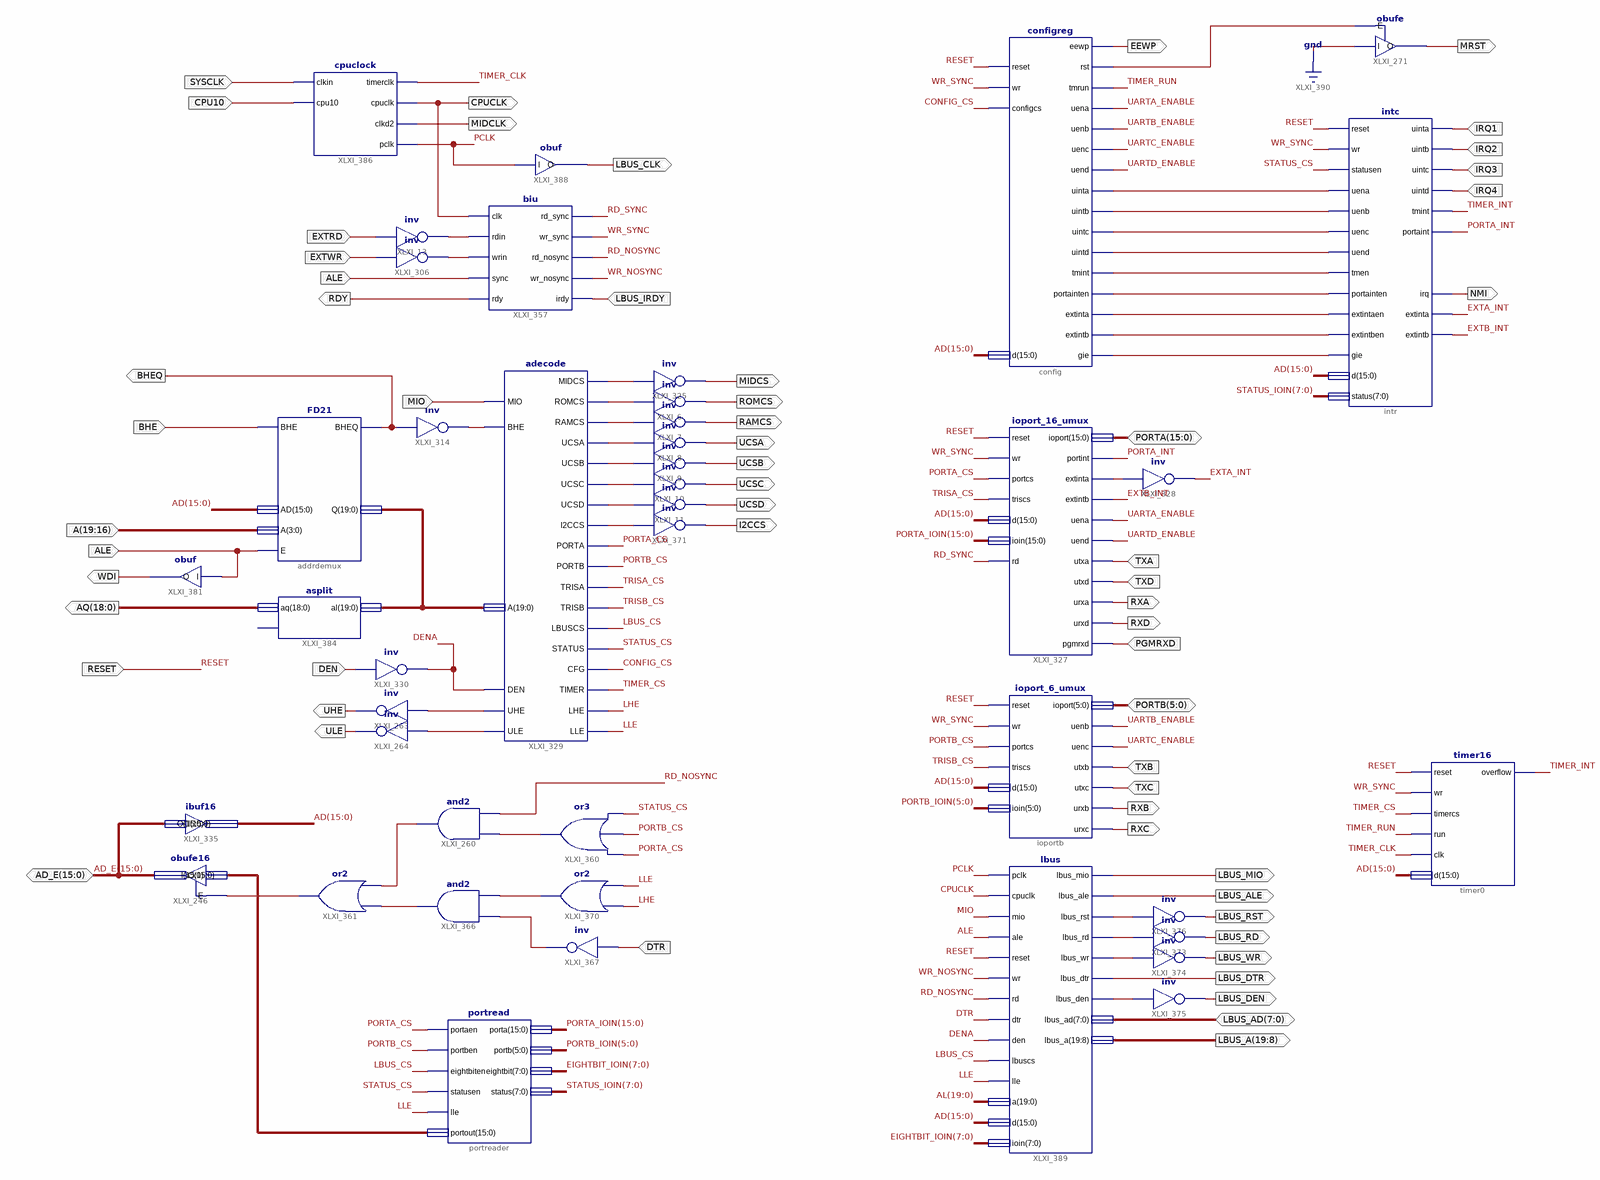
[diagram p0: schematic sheet 1]
// Xilinx ISE schematic main.sch (xc9500) as structural Verilog: 42 symbols, 57 ports
module main (
  input  ALE,
  input  RESET,
  input  EXTWR,
  input  EXTRD,
  input  SYSCLK,
  input  CPU10,
  input  BHE,
  input  [19:16] A,
  input  MIO,
  input  IRQ1,
  input  IRQ4,
  input  IRQ3,
  input  IRQ2,
  input  TXA,
  input  TXD,
  input  PGMRXD,
  input  TXB,
  input  TXC,
  input  DEN,
  input  DTR,
  input  LBUS_IRDY,
  inout  [15:0] PORTA,
  inout  [5:0] PORTB,
  inout  [15:0] AD_E,
  inout  [7:0] LBUS_AD,
  output MIDCLK,
  output ROMCS,
  output RAMCS,
  output UCSA,
  output UCSB,
  output UCSC,
  output UCSD,
  output BHEQ,
  output MIDCS,
  output NMI,
  output EEWP,
  output MRST,
  output RXA,
  output RXD,
  output RXB,
  output RXC,
  output ULE,
  output UHE,
  output I2CCS,
  output RDY,
  output WDI,
  output [18:0] AQ,
  output CPUCLK,
  output LBUS_ALE,
  output LBUS_RST,
  output LBUS_DEN,
  output LBUS_WR,
  output LBUS_RD,
  output LBUS_DTR,
  output LBUS_MIO,
  output [19:8] LBUS_A,
  output LBUS_CLK
);

  wire CONFIG_CS, DENA, EXTA_INT, EXTB_INT, LBUS_CS, LHE, LLE, PCLK, PORTA_CS, PORTA_INT, PORTB_CS,
       RD_NOSYNC, RD_SYNC, STATUS_CS, TIMER_CLK, TIMER_CS, TIMER_INT, TIMER_RUN, TRISA_CS, TRISB_CS,
       UARTA_ENABLE, UARTB_ENABLE, UARTC_ENABLE, UARTD_ENABLE, WR_NOSYNC, WR_SYNC, XLXN_19, XLXN_20, XLXN_21,
       XLXN_22, XLXN_23, XLXN_24, XLXN_444, XLXN_451, XLXN_2395, XLXN_2401, XLXN_2464, XLXN_2860, XLXN_2861,
       XLXN_2862, XLXN_2863, XLXN_2864, XLXN_2865, XLXN_2866, XLXN_2867, XLXN_2872, XLXN_3045, XLXN_3146,
       XLXN_3225, XLXN_3226, XLXN_3237, XLXN_3239, XLXN_3248, XLXN_3275, XLXN_3285, XLXN_3286, XLXN_3288,
       XLXN_3289, XLXN_3297, XLXN_3298;
  wire [5:0] PORTB_IOIN;
  wire [7:0] EIGHTBIT_IOIN, STATUS_IOIN;
  wire [15:0] AD, PORTA_IOIN, XLXN_3213;
  wire [19:0] AL;

  not XLXI_306 (XLXN_2395, EXTWR);
  not XLXI_13 (XLXN_2401, EXTRD);
  FD21 addrdemux (.BHE(BHE), .AD(AD), .A(A), .BHEQ(BHEQ), .Q(AL), .E(ALE));
  not XLXI_314 (XLXN_444, BHEQ);
  adecode XLXI_329 (
    .MIO(MIO), .BHE(XLXN_444), .DEN(DENA), .A(AL), .ROMCS(XLXN_19), .RAMCS(XLXN_20), .UCSA(XLXN_21),
    .UCSB(XLXN_22), .UCSC(XLXN_23), .UCSD(XLXN_24), .STATUS(STATUS_CS), .CFG(CONFIG_CS), .MIDCS(XLXN_2464),
    .TIMER(TIMER_CS), .UHE(XLXN_451), .ULE(XLXN_3146), .LHE(LHE), .LLE(LLE), .LBUSCS(LBUS_CS),
    .I2CCS(XLXN_3285), .PORTA(PORTA_CS), .PORTB(PORTB_CS), .TRISA(TRISA_CS), .TRISB(TRISB_CS));
  not XLXI_10 (UCSC, XLXN_23);
  not XLXI_9 (UCSB, XLXN_22);
  not XLXI_7 (RAMCS, XLXN_20);
  not XLXI_8 (UCSA, XLXN_21);
  not XLXI_11 (UCSD, XLXN_24);
  not XLXI_6 (ROMCS, XLXN_19);
  not XLXI_325 (MIDCS, XLXN_2464);
  configreg \config  (
    .reset(RESET), .wr(WR_SYNC), .configcs(CONFIG_CS), .eewp(EEWP), .rst(XLXN_3298), .tmrun(TIMER_RUN),
    .uena(UARTA_ENABLE), .uenb(UARTB_ENABLE), .uenc(UARTC_ENABLE), .uend(UARTD_ENABLE), .uinta(XLXN_2872),
    .uintb(XLXN_2867), .uintc(XLXN_2866), .uintd(XLXN_2865), .tmint(XLXN_2864), .portainten(XLXN_2863),
    .extinta(XLXN_2862), .extintb(XLXN_2861), .gie(XLXN_2860), .d(AD));
  intc intr (
    .reset(RESET), .wr(WR_SYNC), .statusen(STATUS_CS), .uena(XLXN_2872), .uenb(XLXN_2867), .uenc(XLXN_2866),
    .uend(XLXN_2865), .tmen(XLXN_2864), .portainten(XLXN_2863), .extintaen(XLXN_2862), .extintben(XLXN_2861),
    .gie(XLXN_2860), .uinta(IRQ1), .uintb(IRQ2), .uintc(IRQ3), .uintd(IRQ4), .tmint(TIMER_INT),
    .portaint(PORTA_INT), .extinta(EXTA_INT), .extintb(EXTB_INT), .d(AD), .irq(NMI), .status(STATUS_IOIN));
  obufe XLXI_271 (.E(XLXN_3298), .I(1'b0), .O(MRST));
  timer16 timer0 (
    .reset(RESET), .wr(WR_SYNC), .timercs(TIMER_CS), .run(TIMER_RUN), .overflow(TIMER_INT), .clk(TIMER_CLK),
    .d(AD));
  ioport_16_umux XLXI_327 (
    .reset(RESET), .wr(WR_SYNC), .rd(RD_SYNC), .portcs(PORTA_CS), .triscs(TRISA_CS), .d(AD), .ioport(PORTA),
    .ioin(PORTA_IOIN), .extinta(XLXN_3045), .extintb(EXTB_INT), .portint(PORTA_INT), .utxa(TXA), .utxd(TXD),
    .uena(UARTA_ENABLE), .uend(UARTD_ENABLE), .urxa(RXA), .urxd(RXD), .pgmrxd(PGMRXD));
  not XLXI_328 (EXTA_INT, XLXN_3045);
  ioport_6_umux ioportb (
    .reset(RESET), .wr(WR_SYNC), .portcs(PORTB_CS), .triscs(TRISB_CS), .utxb(TXB), .utxc(TXC),
    .uenb(UARTB_ENABLE), .uenc(UARTC_ENABLE), .d(AD), .ioport(PORTB), .urxb(RXB), .urxc(RXC),
    .ioin(PORTB_IOIN));
  not XLXI_263 (UHE, XLXN_451);
  not XLXI_264 (ULE, XLXN_3146);
  not XLXI_330 (DENA, DEN);
  obufe16 XLXI_246 (.E(XLXN_3226), .I(XLXN_3213), .O(AD_E));
  ibuf16 XLXI_335 (.I(AD_E), .O(AD));
  portread portreader (
    .portaen(PORTA_CS), .portben(PORTB_CS), .statusen(STATUS_CS), .porta(PORTA_IOIN), .portb(PORTB_IOIN),
    .status(STATUS_IOIN), .eightbit(EIGHTBIT_IOIN), .eightbiten(LBUS_CS), .lle(LLE), .portout(XLXN_3213));
  biu XLXI_357 (
    .sync(ALE), .clk(CPUCLK), .rdin(XLXN_2401), .wrin(XLXN_2395), .irdy(LBUS_IRDY), .rd_nosync(RD_NOSYNC),
    .wr_nosync(WR_NOSYNC), .rd_sync(RD_SYNC), .wr_sync(WR_SYNC), .rdy(RDY));
  or XLXI_361 (XLXN_3226, XLXN_3275, XLXN_3237);
  and XLXI_366 (XLXN_3275, XLXN_3239, XLXN_3248);
  and XLXI_260 (XLXN_3237, RD_NOSYNC, XLXN_3225);
  or XLXI_360 (XLXN_3225, PORTA_CS, PORTB_CS, STATUS_CS);
  not XLXI_367 (XLXN_3239, DTR);
  or XLXI_370 (XLXN_3248, LHE, LLE);
  not XLXI_371 (I2CCS, XLXN_3285);
  obuf XLXI_381 (.I(ALE), .O(WDI));
  asplit XLXI_384 (.al(AL), .aq(AQ));  // open: a19
  cpuclock XLXI_386 (.clkin(SYSCLK), .cpu10(CPU10), .timerclk(TIMER_CLK), .cpuclk(CPUCLK), .clkd2(MIDCLK), .pclk(PCLK));
  not XLXI_376 (LBUS_RST, XLXN_3297);
  not XLXI_373 (LBUS_RD, XLXN_3286);
  not XLXI_375 (LBUS_DEN, XLXN_3289);
  not XLXI_374 (LBUS_WR, XLXN_3288);
  obuf XLXI_388 (.I(PCLK), .O(LBUS_CLK));
  lbus XLXI_389 (
    .cpuclk(CPUCLK), .ale(ALE), .reset(RESET), .wr(WR_NOSYNC), .rd(RD_NOSYNC), .mio(MIO), .dtr(DTR),
    .den(DENA), .lle(LLE), .lbuscs(LBUS_CS), .a(AL), .d(AD), .ioin(EIGHTBIT_IOIN), .pclk(PCLK),
    .lbus_ad(LBUS_AD), .lbus_mio(LBUS_MIO), .lbus_dtr(LBUS_DTR), .lbus_den(XLXN_3289), .lbus_rd(XLXN_3286),
    .lbus_wr(XLXN_3288), .lbus_rst(XLXN_3297), .lbus_ale(LBUS_ALE), .lbus_a(LBUS_A));
endmodule
